# Altium project DATN2022.Datalogger.Hardware.PrjPCB
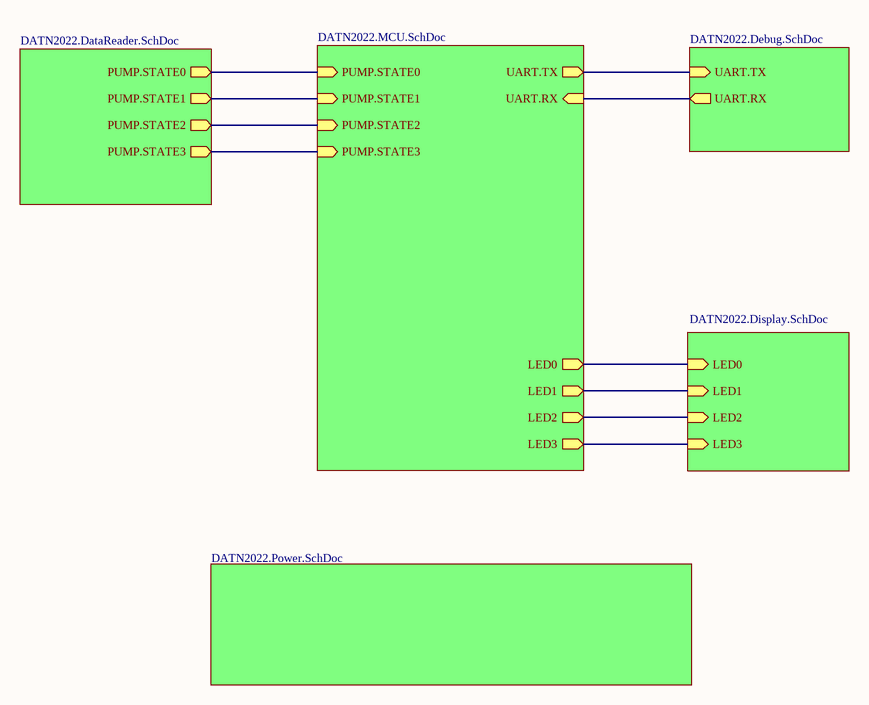
[diagram p0: DATN2022.Datalogger.Hardware.SchDoc]
6 sheets, 72 parts. Net scope: hierarchical (ports join the sheet entries above them; power ports are global).
Board file: DATN2022.Datalogger.Hardware.PcbDoc
Sheets:
  DATN2022.Datalogger.Hardware.SchDoc
     = DATN2022.Power.SchDoc
     = DATN2022.MCU.SchDoc
     = DATN2022.DataReader.SchDoc
     = DATN2022.Debug.SchDoc
     = DATN2022.Display.SchDoc

## Sheet DATN2022.Datalogger.Hardware.SchDoc
size A

### Sub-sheets
? = DATN2022.Power.SchDoc: no entries
? = DATN2022.MCU.SchDoc: PUMP.STATE0 (in), PUMP.STATE1 (in), PUMP.STATE2 (in), PUMP.STATE3 (in), UART.TX (out), UART.RX (in), LED0 (out), LED1 (out), LED2 (out), LED3 (out)
? = DATN2022.DataReader.SchDoc: PUMP.STATE0 (out), PUMP.STATE1 (out), PUMP.STATE2 (out), PUMP.STATE3 (out)
? = DATN2022.Debug.SchDoc: UART.TX (in), UART.RX (out)
? = DATN2022.Display.SchDoc: LED0 (in), LED1 (in), LED2 (in), LED3 (in)

### Nets
PUMP_INPUT0: sheet /PUMP.STATE0, sheet /PUMP.STATE0
PUMP_INPUT1: sheet /PUMP.STATE1, sheet /PUMP.STATE1
PUMP_INPUT2: sheet /PUMP.STATE2, sheet /PUMP.STATE2
PUMP_INPUT3: sheet /PUMP.STATE3, sheet /PUMP.STATE3
NetNode400_17: sheet /LED3, sheet /LED3
NetNode400_18: sheet /LED2, sheet /LED2
NetNode400_19: sheet /LED1, sheet /LED1
NetNode400_20: sheet /LED0, sheet /LED0
NetNode400_27: sheet /UART.RX, sheet /UART.RX
NetNode400_28: sheet /UART.TX, sheet /UART.TX

## Sheet DATN2022.Power.SchDoc
size A
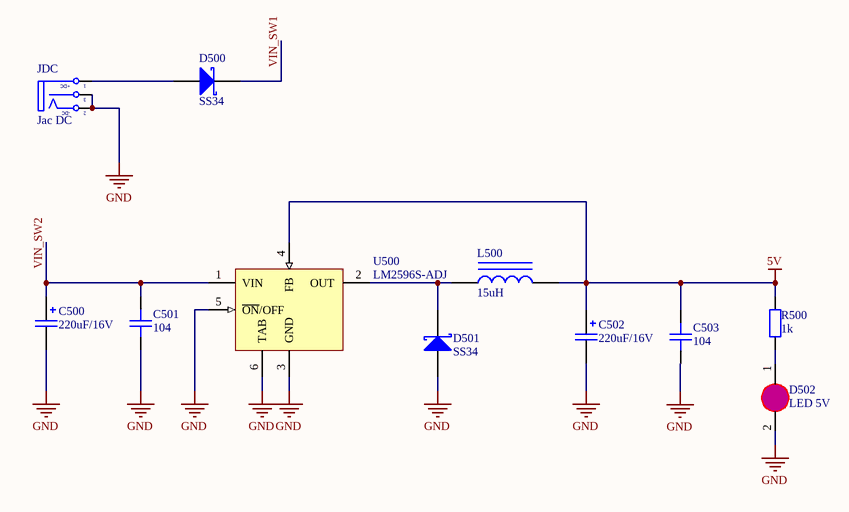
[diagram p1: DATN2022.Power.SchDoc]

### Parts
C500  220uF/16V  [CAP_ALUM_SMD_6377_TYPE_D8]
C501  104  [CAP_CERAMIC_0805(2012mm)]
C502  220uF/16V  [CAP_ALUM_SMD_6377_TYPE_D8]
C503  104  [CAP_CERAMIC_0805(2012mm)]
D500  SS34  [DO214AC_SMA_1808]
D501  SS34  [DO214AC_SMA_1808]
D502  LED 5V  [LED_0805_RED]
JDC  Jac DC  [DC0]
L500  15uH  [INDUCTOR_SMD_12.5x12.5MM]
R500  1k  [RES_0805(2012)]
U500  LM2596S-ADJ  [TO-263-5]

### Nets
5V: C502.1 C503.2 L500.2 R500.2 U500.4(FB)
GND: C500.2 C501.1 C502.2 C503.1 D501.1(A) D502.2(K) JDC.2(TN) JDC.3(S) U500.3(GND) U500.5(~{ON}/OFF) U500.6(TAB)
VIN_SW1: D500.2(K)
VIN_SW2: C500.1 C501.2 U500.1(VIN)
NetD500_1: D500.1(A) JDC.1(T)
NetD501_2: D501.2(K) L500.1 U500.2(OUT)
NetD502_1: D502.1(A) R500.1

### Notes on the sheet
- (in symbol DCIN) +DC; -DC

### Library data of the parts
C500 C502 = UWT1C221MCL1GS: CAP ALUM 220UF 16V 20% SMD; Manufacturer: Nichicon; Capacitance: 220µF; Lifetime @ Temp.: 1000 Hrs @ 105°C; Ripple Current: 105mA; Surface Mount Land Size: 0.260" L x 0.260" W (6.60mm x 6.60mm); Supplier 1: Digi-Key; Manufacturer Part Number: UWT1C221MCL1GS; RoHS: RoHS Compliant; Category: Capacitors; Stock 1: 45106; Pricing 1: 1=0.46, 10=0.366, 100=0.2205, 250=0.16536 (USD); Voltage Rating: 16V; Tolerance: ±20%; Operating Temperature: -55°C ~ 105°C; Features: General Purpose; ESR (Equivalent Series Resistance): -; Impedance: -; Mounting Type: Surface Mount; Package / Case: Radial, Can - SMD; Size / Dimension: 0.248" Dia (6.30mm); Height - Seated (Max): 0.303" (7.70mm); Lead Spacing: -; Packaging: Cut Tape (CT); ComponentLink1URL: http://www.nichicon.co.jp/english/products/pdfs/e-wt.pdf; ComponentLink1Description: http://www.nichicon.co.jp/english/products/pdfs/e-wt.pdf; Supplier Part Number 1: 493-2179-1-ND
C501 C503 = Cap Cer 0805 (2012): Capacitor Ceramic SMD 0805(2012); Value: 33p; Type: Tụ Ceramic; Published: 8-Jun-2000; LatestRevisionDate: 17-Jul-2002; LatestRevisionNote: Re-released for DXP Platform.; PackageReference: RAD-0.3; Publisher: Altium Limited; Component Type: Tụ Ceramic
D500 D501 = Diode B340A: Schottky Diode; Published: 8-Jun-2000; LatestRevisionDate: 17-Jul-2002; LatestRevisionNote: Re-released for DXP Platform.; PackageReference: SMB; Publisher: Altium Limited; Code_JEDEC: DO-214-AA
D502 = LED0805: LED SMD 0805
JDC = DCIN: Jac DC input; Value: Jac DC
L500 = SRR1260-150MCT-ND: INDUCTOR POWER 15UH 5.0A SMD; Manufacturer: Bourns Inc.; Type: Ferrite Core; Inductance: 15µH; Current Rating: 5A; Current - Saturation: 4.6A; Tolerance: ±20%; Material - Core: Ferrite; Shielding: Shielded; DC Resistance (DCR): 27 mOhm Max; Q @ Freq: 25 @ 2.52MHz; Frequency - Self Resonant: 17.6MHz; Frequency - Test: 100kHz; Supplier 1: Digi-Key; Manufacturer Part Number: SRR1260-150M; RoHS: RoHS Compliant; Category: Inductors, Coils, Chokes; Stock 1: 0; Pricing 1: 1=0.93, 10=0.872, 25=0.8136, 50=0.6976, 100=0.6626, 250=0.60452 (USD); Packaging: Cut Tape (CT); Operating Temperature: -40°C ~ 125°C; Package / Case: Non Standard; Size / Dimension: 0.492" L x 0.492" W x 0.236" H (12.50mm x 12.50mm x 6.00mm); Mounting Type: Surface Mount; ComponentLink1URL: http://www.bourns.com/data/global/pdfs/SRR1260.pdf; ComponentLink1Description: http://www.bourns.com/data/global/pdfs/SRR1260.pdf; Supplier Part Number 1: SRR1260-150MCT-ND
R500 = R0805: Resistor SMD 0805; Value: 0805; Published: 8-Jun-2000; LatestRevisionDate: 17-Jul-2002; LatestRevisionNote: Re-released for DXP Platform.; PackageReference: AXIAL-0.4; Publisher: Altium Limited
U500 = LM2596S-ADJ: SIMPLE SWITCHER Power Converter 150 KHz 3A Step-Down Voltage Regulator; Manufacturer: National Semiconductor; PackageTopMarking: NSUZXYTT*LM2596S*-ADJ P+; PowerWise: N; FirstPublished: 4-Dec-2008; DatasheetVersion: May-2002; PackageVersion: revD, Apr-2005; PackageReference: TS5B; Publisher: Altium Limited; PackageDescription: TO-263, Molded, .400 x .390 x .180in, 5 Lead, .067in Pitch, Surface Mount; CompType: Switcher; PartNumber: LM2596S-ADJ; RoHS: O; PinCount: 5; DigiKeyPartNumber: LM2596S-ADJ-ND; Code_JEDEC: MO-169-AB; ComponentLink1Description: LM2596 Datasheet; ComponentLink1URL: http://www.national.com/ds/LM/LM2596.pdf; ComponentLink2Description: LM2596 Web Page; ComponentLink2URL: http://www.national.com/pf/LM/LM2596.html; ComponentLink3Description: TS5B Package Page; ComponentLink3URL: http://www.national.com/packaging/folders/ts5b.html

## Sheet DATN2022.MCU.SchDoc
size A
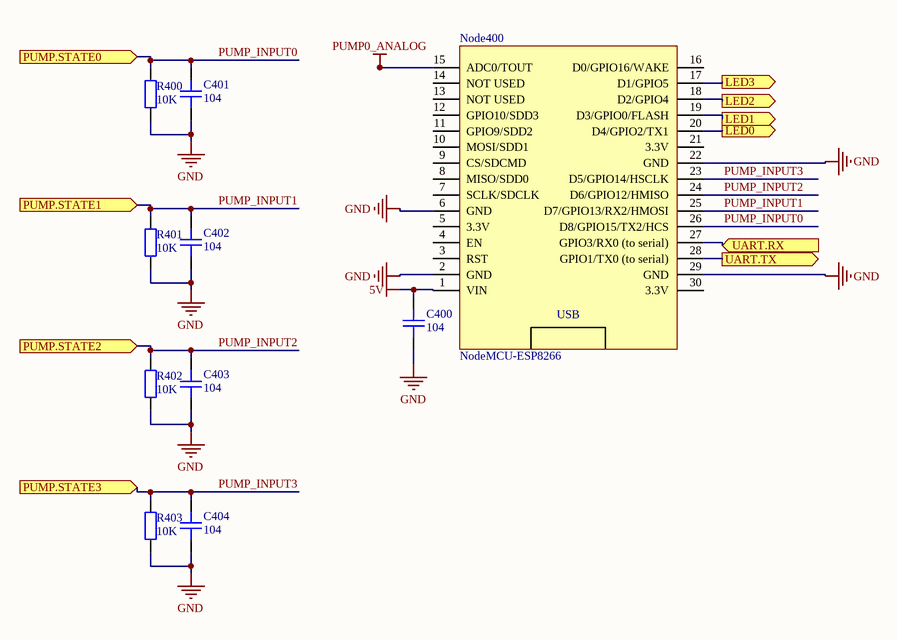
[diagram p2: DATN2022.MCU.SchDoc]

### Parts
C400  104  [CAP_CERAMIC_0805(2012mm)]
C401  104  [CAP_CERAMIC_0805(2012mm)]
C402  104  [CAP_CERAMIC_0805(2012mm)]
C403  104  [CAP_CERAMIC_0805(2012mm)]
C404  104  [CAP_CERAMIC_0805(2012mm)]
Node400  NodeMCU-ESP8266  [NodeMCU_ESP8266]
R400  10K  [RES_0805(2012)]
R401  10K  [RES_0805(2012)]
R402  10K  [RES_0805(2012)]
R403  10K  [RES_0805(2012)]

### Ports
LED0 (out), LED1 (out), LED2 (out), LED3 (out), PUMP.STATE0 (in), PUMP.STATE1 (in), PUMP.STATE2 (in), PUMP.STATE3 (in), UART.RX (in), UART.TX (out)

### Nets
5V: C400.2 Node400.1(VIN)
GND: C400.1 C401.1 C402.1 C403.1 C404.1 Node400.2(GND) Node400.6(GND) Node400.22(GND) Node400.29(GND) R400.1 R401.1 R402.1 R403.1
PUMP0_ANALOG: Node400.15(ADC0/TOUT)
PUMP_INPUT0: C401.2 Node400.26(D8/GPIO15/TX2/HCS) R400.2 ; port PUMP.STATE0
PUMP_INPUT1: C402.2 Node400.25(D7/GPIO13/RX2/HMOSI) R401.2 ; port PUMP.STATE1
PUMP_INPUT2: C403.2 Node400.24(D6/GPIO12/HMISO) R402.2 ; port PUMP.STATE2
PUMP_INPUT3: C404.2 Node400.23(D5/GPIO14/HSCLK) R403.2 ; port PUMP.STATE3
NetNode400_17: Node400.17(D1/GPIO5) ; port LED3
NetNode400_18: Node400.18(D2/GPIO4) ; port LED2
NetNode400_19: Node400.19(D3/GPIO0/FLASH) ; port LED1
NetNode400_20: Node400.20(D4/GPIO2/TX1) ; port LED0
NetNode400_27: Node400.27(GPIO3/RX0_(to_serial)) ; port UART.RX
NetNode400_28: Node400.28(GPIO1/TX0_(to_serial)) ; port UART.TX

Not connected (* = marked no-connect by the designer): Node400 3(RST) 4(EN) 5(3.3V) 7(SCLK/SDCLK) 8(MISO/SDD0) 9(CS/SDCMD) 10(MOSI/SDD1) 11(GPIO9/SDD2) 12(GPIO10/SDD3) 13(NOT_USED) 14(NOT_USED) 16(D0/GPIO16/WAKE) 21(3.3V) 30(3.3V)

### Notes on the sheet
- (in symbol NodeMCU_ESP8266) USB

### Library data of the parts
C400-C404 = Cap Cer 0805 (2012): as C501 on sheet DATN2022.Power; Published: 8-Jun-2000; LatestRevisionDate: 17-Jul-2002; LatestRevisionNote: Re-released for DXP Platform.; PackageReference: RAD-0.3; Publisher: Altium Limited; Component Type: Tụ Ceramic
Node400 = NodeMCU_ESP8266
R400-R403 = R0805: Resistor SMD 0805; Value: 0805; Published: 8-Jun-2000; LatestRevisionDate: 17-Jul-2002; LatestRevisionNote: Re-released for DXP Platform.; PackageReference: AXIAL-0.4; Publisher: Altium Limited

## Sheet DATN2022.DataReader.SchDoc
size A3
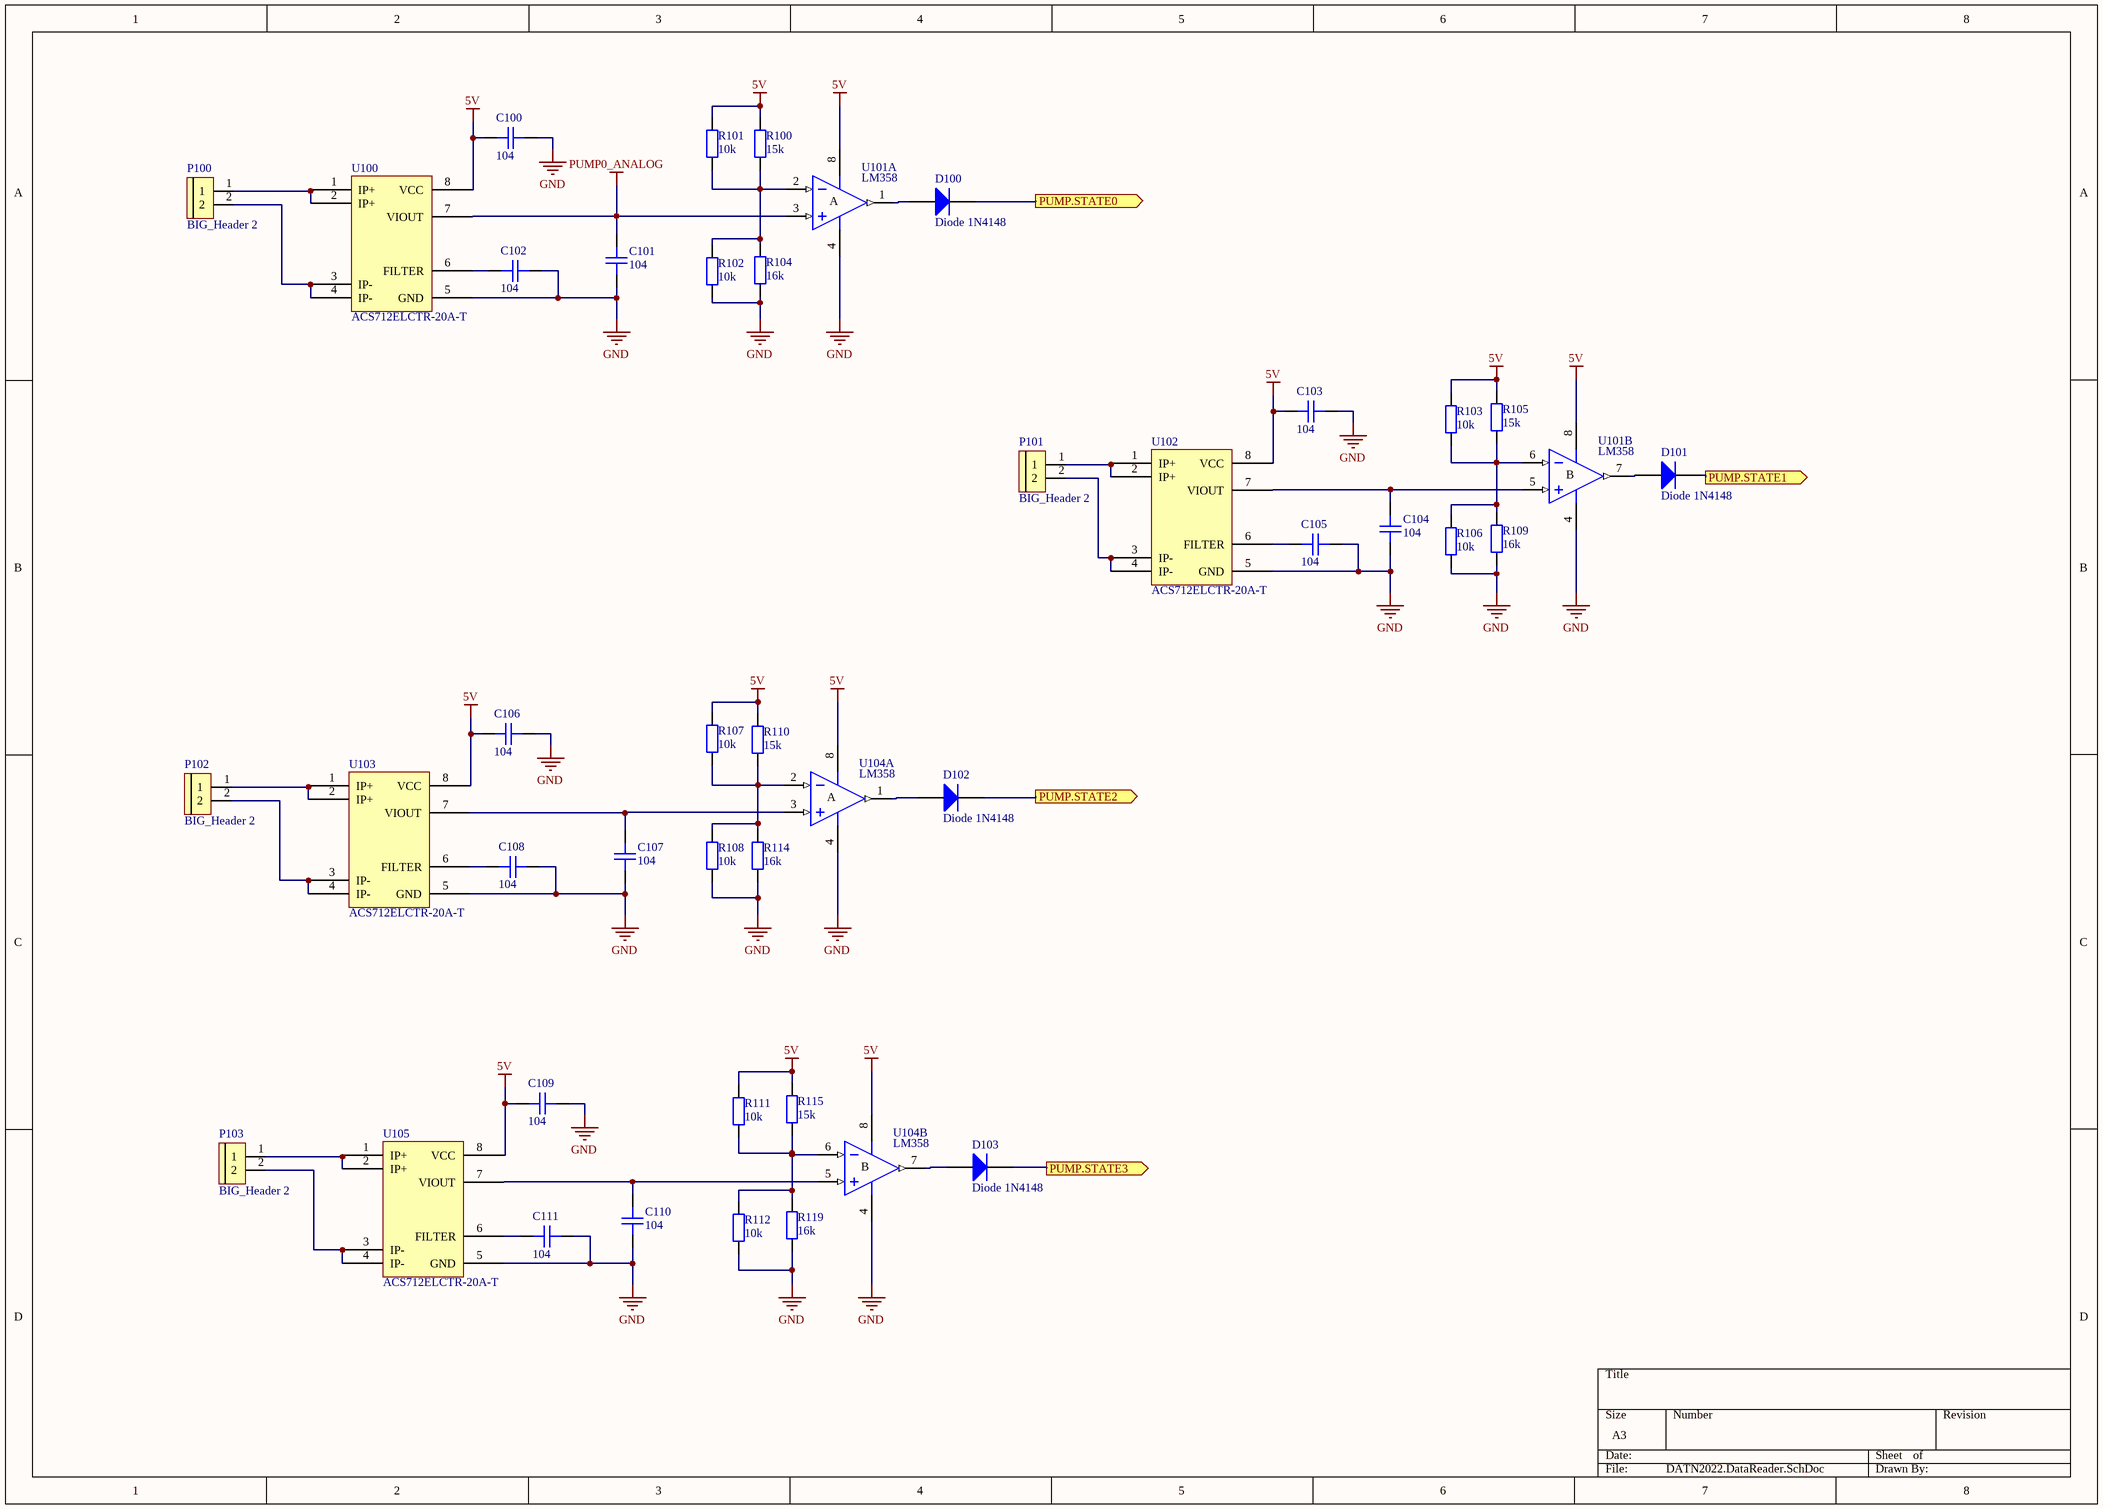
[diagram p3: DATN2022.DataReader.SchDoc]

### Parts
C100  104  [CAP_CERAMIC_0805(2012mm)]
C101  104  [CAP_CERAMIC_0805(2012mm)]
C102  104  [CAP_CERAMIC_0805(2012mm)]
C103  104  [CAP_CERAMIC_0805(2012mm)]
C104  104  [CAP_CERAMIC_0805(2012mm)]
C105  104  [CAP_CERAMIC_0805(2012mm)]
C106  104  [CAP_CERAMIC_0805(2012mm)]
C107  104  [CAP_CERAMIC_0805(2012mm)]
C108  104  [CAP_CERAMIC_0805(2012mm)]
C109  104  [CAP_CERAMIC_0805(2012mm)]
C110  104  [CAP_CERAMIC_0805(2012mm)]
C111  104  [CAP_CERAMIC_0805(2012mm)]
D100  Diode 1N4148  [DO214AC_SMA_1808]
D101  Diode 1N4148  [DO214AC_SMA_1808]
D102  Diode 1N4148  [DO214AC_SMA_1808]
D103  Diode 1N4148  [DO214AC_SMA_1808]
P100  BIG_Header 2  [KF128-2P]
P101  BIG_Header 2  [KF128-2P]
P102  BIG_Header 2  [KF128-2P]
P103  BIG_Header 2  [KF128-2P]
R100  15k  [RES_0805(2012)]
R101  10k  [RES_0805(2012)]
R102  10k  [RES_0805(2012)]
R103  10k  [RES_0805(2012)]
R104  16k  [RES_0805(2012)]
R105  15k  [RES_0805(2012)]
R106  10k  [RES_0805(2012)]
R107  10k  [RES_0805(2012)]
R108  10k  [RES_0805(2012)]
R109  16k  [RES_0805(2012)]
R110  15k  [RES_0805(2012)]
R111  10k  [RES_0805(2012)]
R112  10k  [RES_0805(2012)]
R114  16k  [RES_0805(2012)]
R115  15k  [RES_0805(2012)]
R119  16k  [RES_0805(2012)]
U100  ACS712ELCTR-20A-T  [SOIC8]
U101  LM358  [SOIC8]  (parts A,B of 2)
U102  ACS712ELCTR-20A-T  [SOIC8]
U103  ACS712ELCTR-20A-T  [SOIC8]
U104  LM358  [SOIC8]  (parts A,B of 2)
U105  ACS712ELCTR-20A-T  [SOIC8]

### Ports
PUMP.STATE0 (out), PUMP.STATE1 (out), PUMP.STATE2 (out), PUMP.STATE3 (out)

### Nets
5V: C100.2 C103.2 C106.2 C109.2 R100.2 R101.1 R103.1 R105.2 R107.1 R110.2 R111.1 R115.2 U100.8(VCC) U101.8(V+) U102.8(VCC) U103.8(VCC) U104.8(V+) U105.8(VCC)
GND: C100.1 C101.2 C102.2 C103.1 C104.2 C105.2 C106.1 C107.2 C108.2 C109.1 C110.2 C111.2 R102.2 R104.1 R106.2 R108.2 R109.1 R112.2 R114.1 R119.1 U100.5(GND) U101.4(V-) U102.5(GND) U103.5(GND) U104.4(V-) U105.5(GND)
PUMP0_ANALOG: C101.1 U100.7(VIOUT) U101.3(IN+)
PUMP_INPUT0: D100.2(K) ; port PUMP.STATE0
PUMP_INPUT1: D101.2(K) ; port PUMP.STATE1
PUMP_INPUT2: D102.2(K) ; port PUMP.STATE2
PUMP_INPUT3: D103.2(K) ; port PUMP.STATE3
NetC102_1: C102.1 U100.6(FILTER)
NetC104_1: C104.1 U101.5(IN+) U102.7(VIOUT)
NetC105_1: C105.1 U102.6(FILTER)
NetC107_1: C107.1 U103.7(VIOUT) U104.3(IN+)
NetC108_1: C108.1 U103.6(FILTER)
NetC110_1: C110.1 U104.5(IN+) U105.7(VIOUT)
NetC111_1: C111.1 U105.6(FILTER)
NetD100_1: D100.1(A) U101.1(OUT)
NetD101_1: D101.1(A) U101.7(OUT)
NetD102_1: D102.1(A) U104.1(OUT)
NetD103_1: D103.1(A) U104.7(OUT)
NetP100_1: P100.1 U100.1(IP+) U100.2(IP+)
NetP100_2: P100.2 U100.3(IP-) U100.4(IP-)
NetP101_1: P101.1 U102.1(IP+) U102.2(IP+)
NetP101_2: P101.2 U102.3(IP-) U102.4(IP-)
NetP102_1: P102.1 U103.1(IP+) U103.2(IP+)
NetP102_2: P102.2 U103.3(IP-) U103.4(IP-)
NetP103_1: P103.1 U105.1(IP+) U105.2(IP+)
NetP103_2: P103.2 U105.3(IP-) U105.4(IP-)
NetR100_1: R100.1 R101.2 R102.1 R104.2 U101.2(IN-)
NetR103_2: R103.2 R105.1 R106.1 R109.2 U101.6(IN-)
NetR107_2: R107.2 R108.1 R110.1 R114.2 U104.2(IN-)
NetR111_2: R111.2 R112.1 R115.1 R119.2 U104.6(IN-)

### Notes on the sheet
- (in symbol LM358, part A) A
- (in symbol LM358, part B) B

### Library data of the parts
C100-C111 = Cap Cer 0805 (2012): as C501 on sheet DATN2022.Power; Published: 8-Jun-2000; LatestRevisionDate: 17-Jul-2002; LatestRevisionNote: Re-released for DXP Platform.; PackageReference: RAD-0.3; Publisher: Altium Limited; Component Type: Tụ Ceramic
D100-D103 = Diode 1N4448: High Conductance Fast Diode; Published: 8-Jun-2000; LatestRevisionDate: 17-Jul-2002; LatestRevisionNote: Re-released for DXP Platform.; DatasheetVersion: 1997; PackageReference: DO-35; Publisher: Altium Limited; PackageDescription: Diode, Axial; Body 3.8 x 1.9 mm (LxDia. max), Lead Dia. 0.53 mm (max); Code_JEDEC: DO-204-AH; ComponentLink1Description: Manufacturer Link; ComponentLink1URL: http://www.fairchildsemi.com/; ComponentLink2Description: Datasheet; ComponentLink2URL: http://www.fairchildsemi.com/ds/1N%2F1N4448.pdf
R100-R112 R114 R115 R119 = R0805: Resistor SMD 0805; Value: 0805; Published: 8-Jun-2000; LatestRevisionDate: 17-Jul-2002; LatestRevisionNote: Re-released for DXP Platform.; PackageReference: AXIAL-0.4; Publisher: Altium Limited
U100 U102 U103 U105 = ACS712ELCTR-20A-T: Current meter IC
U101 U104 = LM358: Dual Operational Amplifier (JFET); Manufacturer: Texas Instruments; Manufacturer Part Number: LM358DR; Amplifier Type: General Purpose; Number of Circuits: 2; Slew Rate: 0.3 V/µs; Gain Bandwidth Product: 700kHz; Current - Input Bias: 20nA; Voltage - Input Offset: 3mV; Current - Supply: 1mA; Current - Output / Channel: 30mA; Voltage - Supply, Single/Dual (±): 3 V ~ 32 V, ±1.5 V ~ 16 V; Creator: Nguyen Ba Bien; Supplier 1: Digi-Key; RoHS: RoHS Compliant; Category: Integrated Circuits (ICs); Stock 1: 13315; Pricing 1: 1=0.55, 10=0.386, 25=0.3176, 100=0.2537, 250=0.1848, 500=0.15008, 1000=0.11536 (USD); Packaging: Cut Tape (CT); Output Type: -; -3db Bandwidth: -; Operating Temperature: 0°C ~ 70°C; Mounting Type: Surface Mount; Package / Case: 8-SOIC (0.154", 3.90mm Width); Supplier Device Package: 8-SOIC; ComponentLink1URL: http://www.ti.com/lit/ds/symlink/lm358.pdf; ComponentLink1Description: http://www.ti.com/lit/ds/symlink/lm358.pdf; Supplier Part Number 1: 296-1014-1-ND

## Sheet DATN2022.Debug.SchDoc
size A
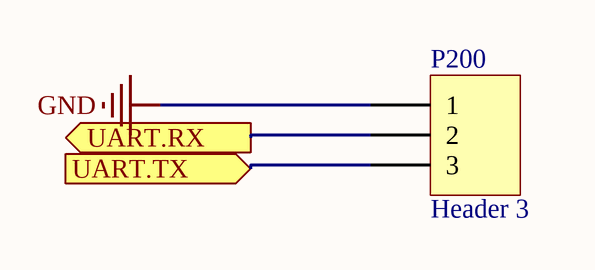
[diagram p4: DATN2022.Debug.SchDoc]

### Parts
P200  Header 3  [HDR1X3]

### Ports
UART.RX (out), UART.TX (in)

### Nets
GND: P200.1
NetNode400_27: P200.2 ; port UART.RX
NetNode400_28: P200.3 ; port UART.TX

### Library data of the parts
P200 = Header 3: Header, 3-Pin; LatestRevisionDate: 17-Jul-2002; LatestRevisionNote: Re-released for DXP Platform.; Publisher: Altium Limited

## Sheet DATN2022.Display.SchDoc
size A
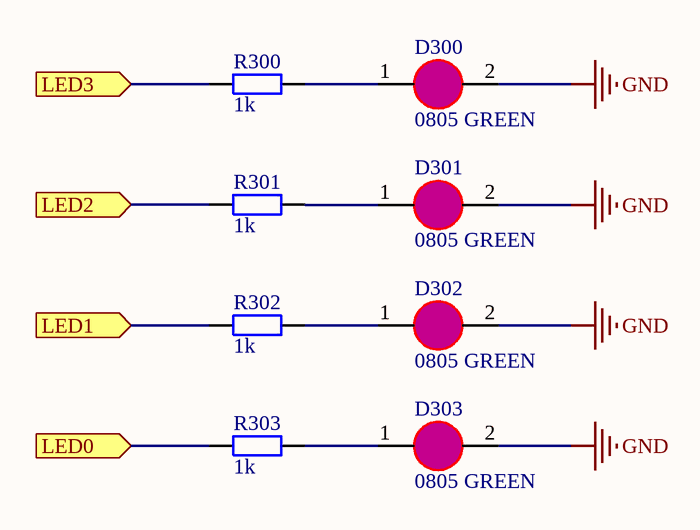
[diagram p5: DATN2022.Display.SchDoc]

### Parts
D300  0805 GREEN  [LED_0805_GREEN]
D301  0805 GREEN  [LED_0805_GREEN]
D302  0805 GREEN  [LED_0805_GREEN]
D303  0805 GREEN  [LED_0805_GREEN]
R300  1k  [RES_0805(2012)]
R301  1k  [RES_0805(2012)]
R302  1k  [RES_0805(2012)]
R303  1k  [RES_0805(2012)]

### Ports
LED0 (in), LED1 (in), LED2 (in), LED3 (in)

### Nets
GND: D300.2(K) D301.2(K) D302.2(K) D303.2(K)
NetD300_1: D300.1(A) R300.2
NetD301_1: D301.1(A) R301.2
NetD302_1: D302.1(A) R302.2
NetD303_1: D303.1(A) R303.2
NetNode400_17: R300.1 ; port LED3
NetNode400_18: R301.1 ; port LED2
NetNode400_19: R302.1 ; port LED1
NetNode400_20: R303.1 ; port LED0

### Library data of the parts
D300-D303 = LED0805: LED SMD 0805
R300-R303 = R0805: Resistor SMD 0805; Value: 0805; Published: 8-Jun-2000; LatestRevisionDate: 17-Jul-2002; LatestRevisionNote: Re-released for DXP Platform.; PackageReference: AXIAL-0.4; Publisher: Altium Limited

## Nets that join several sheets
5V: DATN2022.Power (5 pins), DATN2022.MCU (C400.2 Node400.1), DATN2022.DataReader (18 pins)
GND: DATN2022.Power (11 pins), DATN2022.MCU (13 pins), DATN2022.DataReader (26 pins), DATN2022.Debug (P200.1), DATN2022.Display (D300.2 D301.2 D302.2 D303.2)
PUMP0_ANALOG: DATN2022.MCU (Node400.15), DATN2022.DataReader (C101.1 U100.7 U101.3)
NetNode400_17: DATN2022.MCU (Node400.17), DATN2022.Display (R300.1)
NetNode400_18: DATN2022.MCU (Node400.18), DATN2022.Display (R301.1)
NetNode400_19: DATN2022.MCU (Node400.19), DATN2022.Display (R302.1)
NetNode400_20: DATN2022.MCU (Node400.20), DATN2022.Display (R303.1)
NetNode400_27: DATN2022.MCU (Node400.27), DATN2022.Debug (P200.2)
NetNode400_28: DATN2022.MCU (Node400.28), DATN2022.Debug (P200.3)
PUMP_INPUT0: DATN2022.MCU (C401.2 Node400.26 R400.2), DATN2022.DataReader (D100.2)
PUMP_INPUT1: DATN2022.MCU (C402.2 Node400.25 R401.2), DATN2022.DataReader (D101.2)
PUMP_INPUT2: DATN2022.MCU (C403.2 Node400.24 R402.2), DATN2022.DataReader (D102.2)
PUMP_INPUT3: DATN2022.MCU (C404.2 Node400.23 R403.2), DATN2022.DataReader (D103.2)